# EasyEDA schematic SCH_Pedal-Pcb-v3-different-batch_2024-05-04.json
TITLE: V3; REV: 1.0; Date: 2023-05-09; Sheet: 1/1; Company: DIY FFB pedal
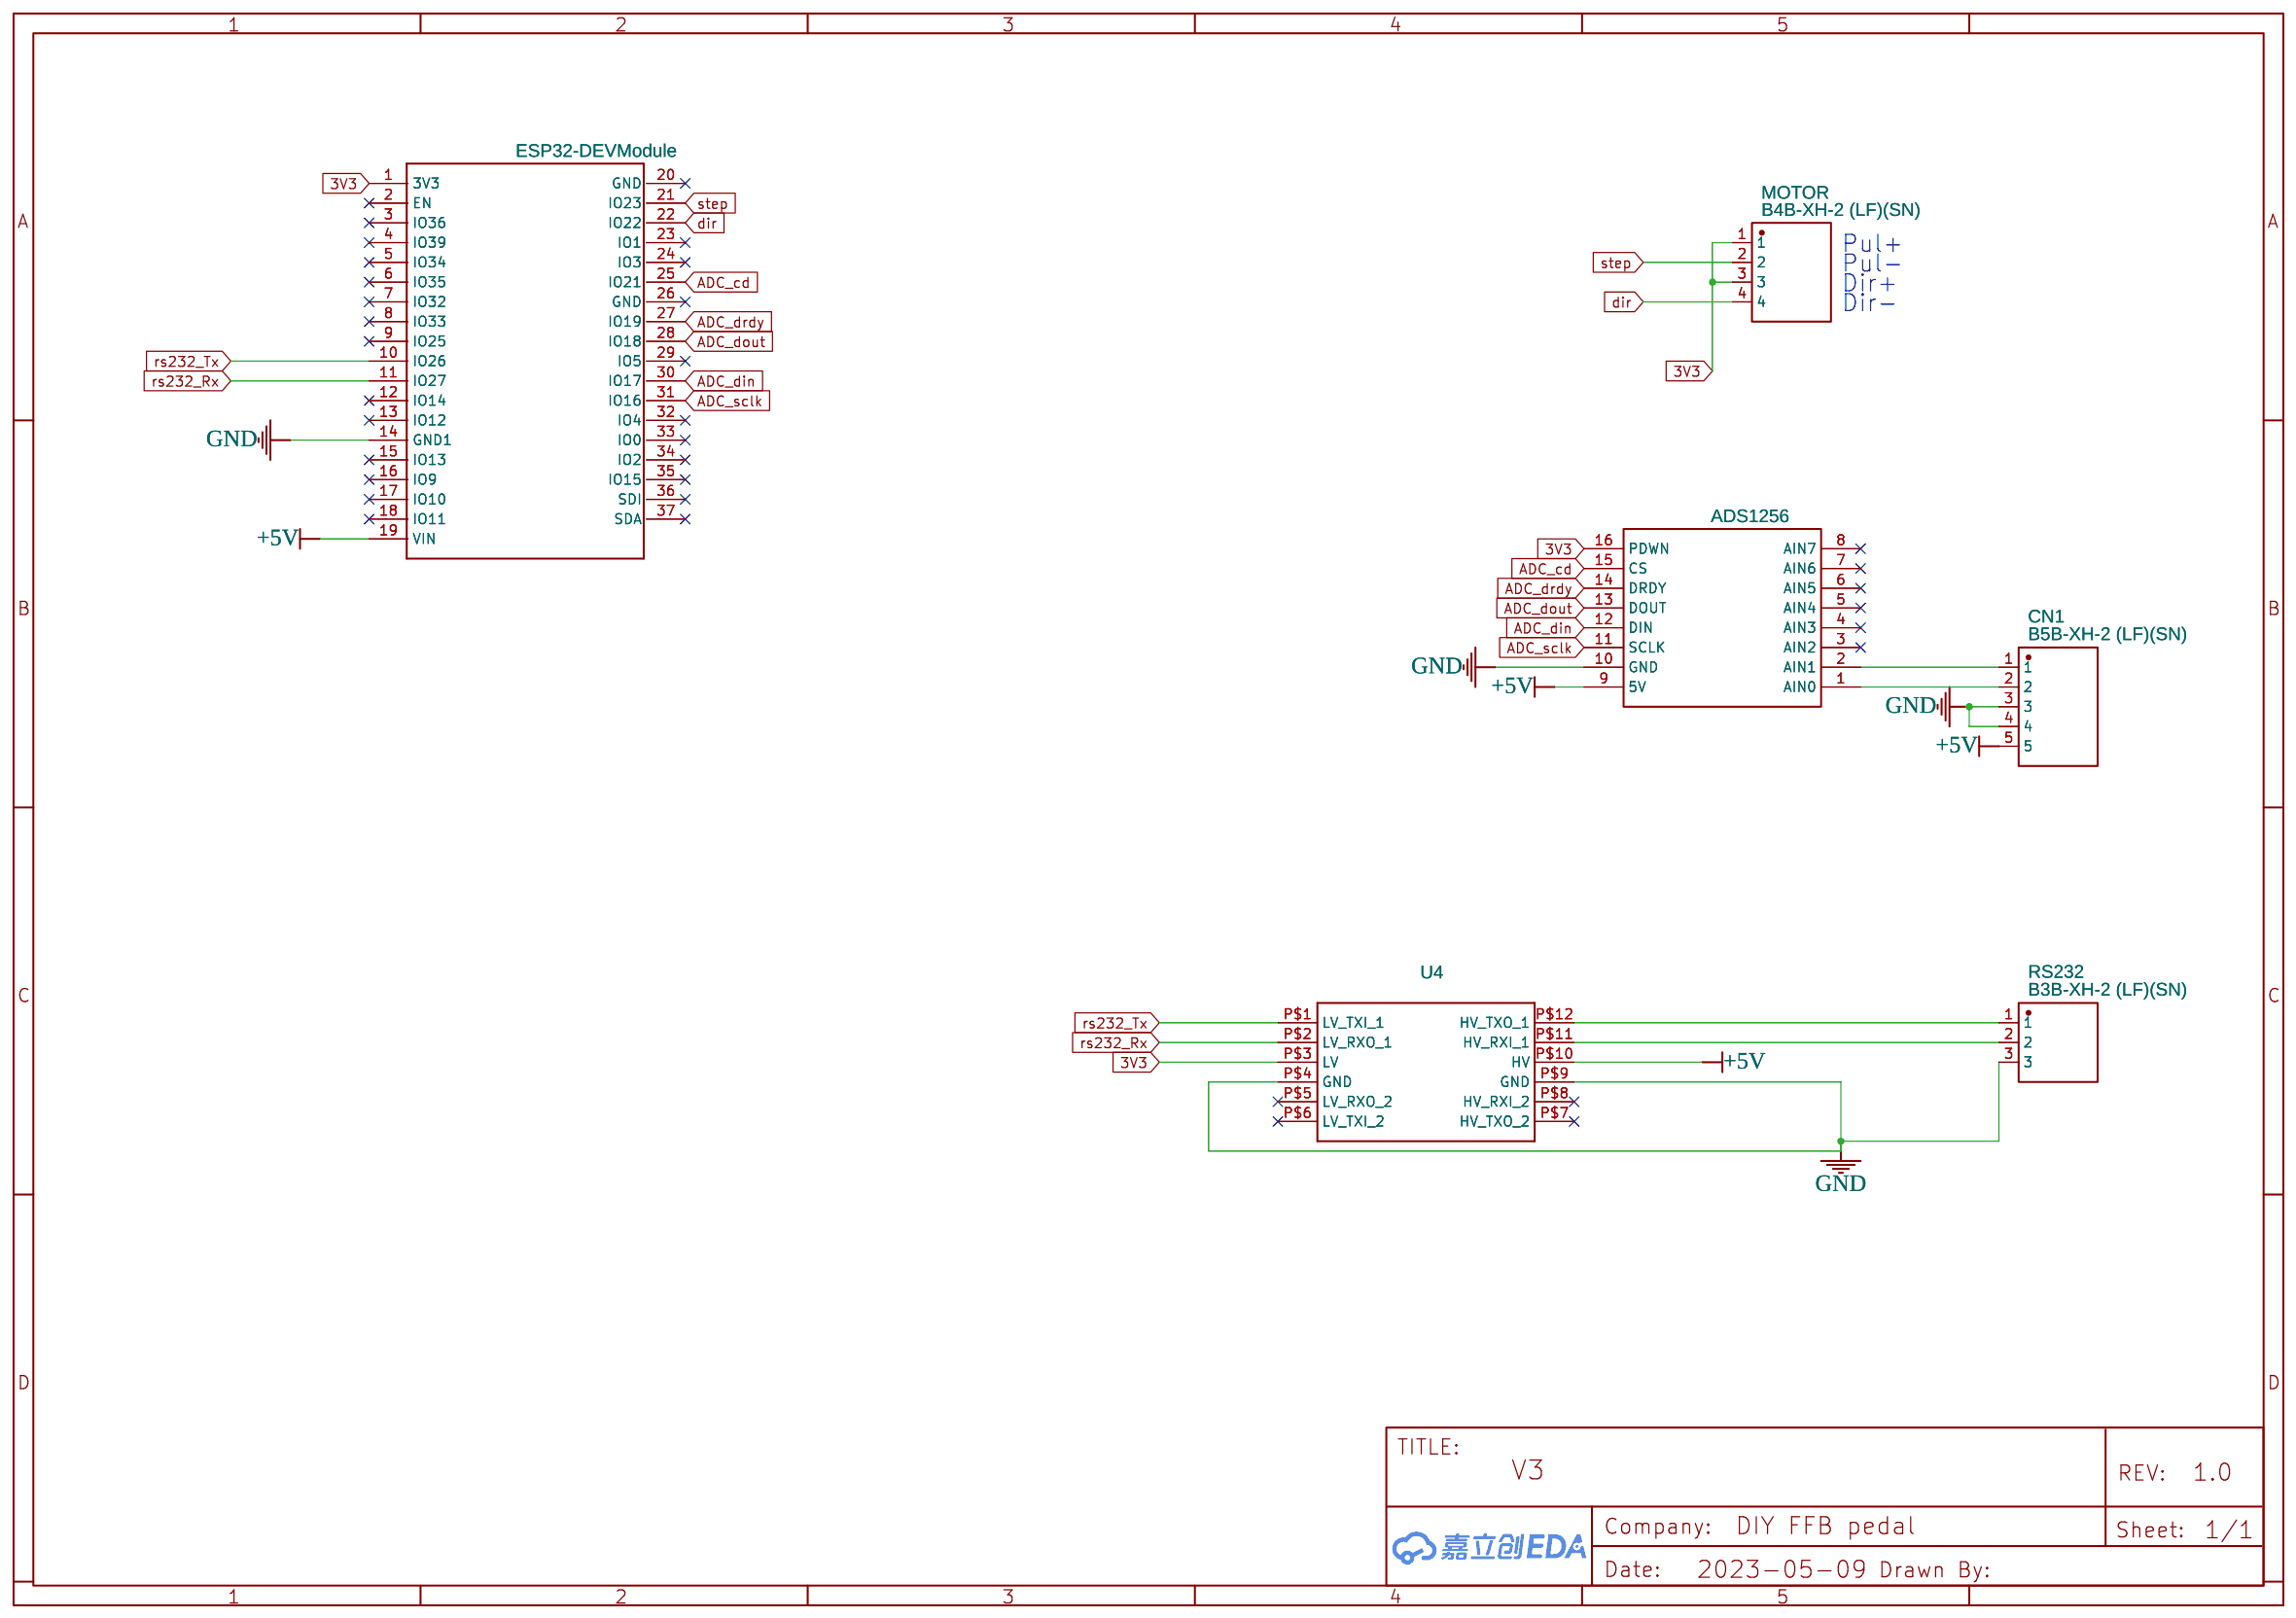
[diagram p0: schematic sheet]

## Parts
CN1  B5B-XH-2 (LF)(SN)  [CONN-TH_B5B-XH-2-LF-SN]
MOTOR  B4B-XH-2 (LF)(SN)  [CONN-TH_B4B-XH-2-LF-SN]
RS232  B3B-XH-2 (LF)(SN)  [CONN-TH_B3B-XH-2-LF-SN]
U3  ADS1256  [ADS1256]
U4  NO  [LOGIC_LEVEL_CONVERTER]
U5  ESP32-DEVModule  [ESP32-DEVKITC-32D_MODULE_ESP32-DEVKITC-32D]

## Library data of the parts
CN1 = B5B-XH-2 (LF)(SN): Contributor: LCSC; Supplier: LCSC; Supplier Part: C157992; Manufacturer: JST; Manufacturer Part: B5B-XH-2(LF)(SN); JLCPCB Part Class: Extended Part; link: https://lcsc.com/eda_search?q=C157992&%26type=1&ref=editor
MOTOR = B4B-XH-2 (LF)(SN): Contributor: LCSC; Supplier: LCSC; Supplier Part: C157999; Manufacturer: JST; Manufacturer Part: B4B-XH-2(LF)(SN); JLCPCB Part Class: Extended Part; link: https://lcsc.com/eda_search?q=C157999&%26type=1&ref=editor
RS232 = B3B-XH-2 (LF)(SN): Contributor: LCSC; Supplier: LCSC; Supplier Part: C158003; Manufacturer: JST; Manufacturer Part: B3B-XH-2(LF)(SN); JLCPCB Part Class: Extended Part; link: https://lcsc.com/eda_search?q=C158003&%26type=1&ref=editor
U3 = ADS1256: link: https://www.amazon.es/DollaTek-ADS1256-8channel-precisi%C3%B3n-adquisici%C3%B3n/dp/B07DK5GC9H/ref=sr_1_1?__mk_es_ES=%C3%85M%C3%85%C5%BD%C3%95%C3%91&dchild=1&keywords=ADS1256&qid=1588184343&sr=8-1; Contributor: jesdefer
U4 = LOGIC_LEVEL_CONVERTER: Logic Level Converter (3.3v - 5v); Contributor: SparkFun
U5 = ESP32-DEVModule: Contributor: munteanm30

## Nets
3V3: MOTOR.1 MOTOR.3 U3.16(PDWN) U4.P$3(LV) U5.1(3V3)
+5V: CN1.5 U3.9(5V) U4.P$10(HV) U5.19(VIN)
GND: CN1.3 CN1.4 RS232.3 U3.10(GND) U4.P$4(GND) U4.P$9(GND) U5.14(GND1)
ADC_cd: U3.15(CS) U5.25(IO21)
ADC_din: U3.12(DIN) U5.30(IO17)
ADC_dout: U3.13(DOUT) U5.28(IO18)
ADC_drdy: U3.14(DRDY) U5.27(IO19)
ADC_sclk: U3.11(SCLK) U5.31(IO16)
dir: MOTOR.4 U5.22(IO22)
rs232_Rx: U4.P$2(LV_RXO_1) U5.11(IO27)
rs232_Tx: U4.P$1(LV_TXI_1) U5.10(IO26)
step: MOTOR.2 U5.21(IO23)
Net-(CN1-1): CN1.1 U3.2(AIN1)
Net-(CN1-2): CN1.2 U3.1(AIN0)
Net-(RS232-1): RS232.1 U4.P$12(HV_TXO_1)
Net-(RS232-2): RS232.2 U4.P$11(HV_RXI_1)

Not connected (* = marked no-connect by the designer): U3 3(AIN2)* 4(AIN3)* 5(AIN4)* 6(AIN5)* 7(AIN6)* 8(AIN7)*; U4 P$5(LV_RXO_2)* P$6(LV_TXI_2)* P$7(HV_TXO_2)* P$8(HV_RXI_2)*; U5 2(EN)* 3(IO36)* 4(IO39)* 5(IO34)* 6(IO35)* 7(IO32)* 8(IO33)* 9(IO25)* 12(IO14)* 13(IO12)* 15(IO13)* 16(IO9)* 17(IO10)* 18(IO11)* 20(GND)* 23(IO1)* 24(IO3)* 26(GND)* 29(IO5)* 32(IO4)* 33(IO0)* 34(IO2)* 35(IO15)* 36(SDI)* 37(SDA)*

## Notes on the sheet
- Pul+
- Pul-
- Dir+
- Dir-
